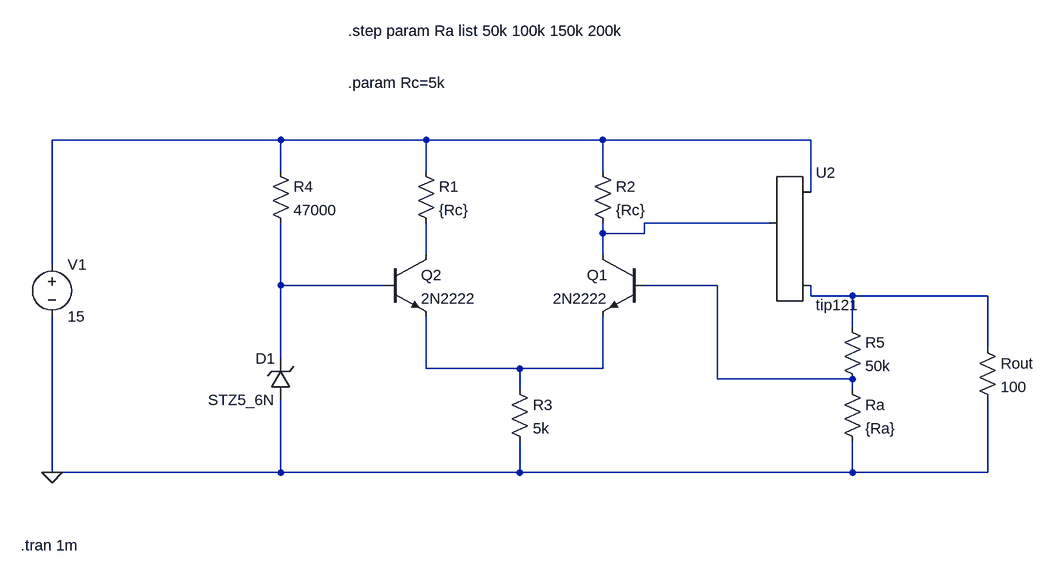
[diagram p0: schematic amp_diff_tip122.asc]
amp_diff_tip122.asc, the LTspice schematic file:
Version 4
SHEET 1 880 680
WIRE -384 -32 -736 -32
WIRE -160 -32 -384 -32
WIRE 112 -32 -160 -32
WIRE 432 -32 112 -32
WIRE -384 16 -384 -32
WIRE -160 16 -160 -32
WIRE 112 16 112 -32
WIRE 432 48 432 -32
WIRE 368 96 176 96
WIRE 112 112 112 96
WIRE 176 112 176 96
WIRE 176 112 112 112
WIRE -160 144 -160 96
WIRE 112 144 112 112
WIRE -736 160 -736 -32
WIRE -384 192 -384 96
WIRE -224 192 -384 192
WIRE 288 192 176 192
WIRE 432 208 432 192
WIRE 496 208 432 208
WIRE 704 208 496 208
WIRE 496 256 496 208
WIRE 704 288 704 208
WIRE -384 304 -384 192
WIRE -160 320 -160 240
WIRE -16 320 -160 320
WIRE 112 320 112 240
WIRE 112 320 -16 320
WIRE 288 336 288 192
WIRE 496 336 288 336
WIRE -16 352 -16 320
WIRE 496 352 496 336
WIRE -736 480 -736 240
WIRE -384 480 -384 368
WIRE -384 480 -736 480
WIRE -16 480 -16 432
WIRE -16 480 -384 480
WIRE 496 480 496 432
WIRE 496 480 -16 480
WIRE 704 480 704 368
WIRE 704 480 496 480
FLAG -736 480 0
SYMBOL npn 176 144 M0
SYMATTR InstName Q1
SYMATTR Value 2N2222
SYMBOL npn -224 144 R0
SYMATTR InstName Q2
SYMATTR Value 2N2222
SYMBOL res -176 0 R0
SYMATTR InstName R1
SYMATTR Value {Rc}
SYMBOL res 96 0 R0
SYMATTR InstName R2
SYMATTR Value {Rc}
SYMBOL res -32 336 R0
SYMATTR InstName R3
SYMATTR Value 5k
SYMBOL res -400 0 R0
SYMATTR InstName R4
SYMATTR Value 47000
SYMBOL res 480 240 R0
SYMATTR InstName R5
SYMATTR Value 50k
SYMBOL res 480 336 R0
SYMATTR InstName Ra
SYMATTR Value {Ra}
SYMBOL res 688 272 R0
SYMATTR InstName Rout
SYMATTR Value 100
SYMBOL sym\\zener -368 368 R180
WINDOW 0 24 64 Left 2
WINDOW 3 24 0 Left 2
SYMATTR InstName D1
SYMATTR Value STZ5_6N
SYMBOL voltage -736 144 R0
SYMATTR InstName V1
SYMATTR Value 15
SYMBOL sym\\ZZZ\\Darlington\\tip121 432 112 R0
SYMATTR InstName U2
TEXT -280 -120 Left 2 !.param Rc=5k
TEXT -784 592 Left 2 !.tran 1m
TEXT -280 -200 Left 2 !.step param Ra list 50k 100k 150k 200k

The netlist it stands for:
* amp_diff_tip122.asc
Q1 N002 N005 N007 0 2N2222
Q2 N003 N004 N007 0 2N2222
R1 N001 N003 {Rc}
R2 N001 N002 {Rc}
R3 N007 0 5k
R4 N001 N004 47000
R5 N006 N005 50k
Ra N005 0 {Ra}
Rout N006 0 100
D1 0 N004 STZ5_6N
V1 N001 0 15
XU2 N001 N002 N006 tip121
.model D D
.lib standard.dio
.model NPN NPN
.model PNP PNP
.lib standard.bjt
.param Rc=5k
.tran 1m
.step param Ra list 50k 100k 150k 200k
.backanno
.end